# Altium schematic sheet MCU.SchDoc: =ProjectTitle
size 297 x 209 mm; Address1: Address1; Address2: Address2; Address3: Address3; Address4: Address4; SheetNumber: 1; SheetTotal: 6; Scale: 1:1; DocumentType: Схема электрическая принципиальная; Title2str: ?
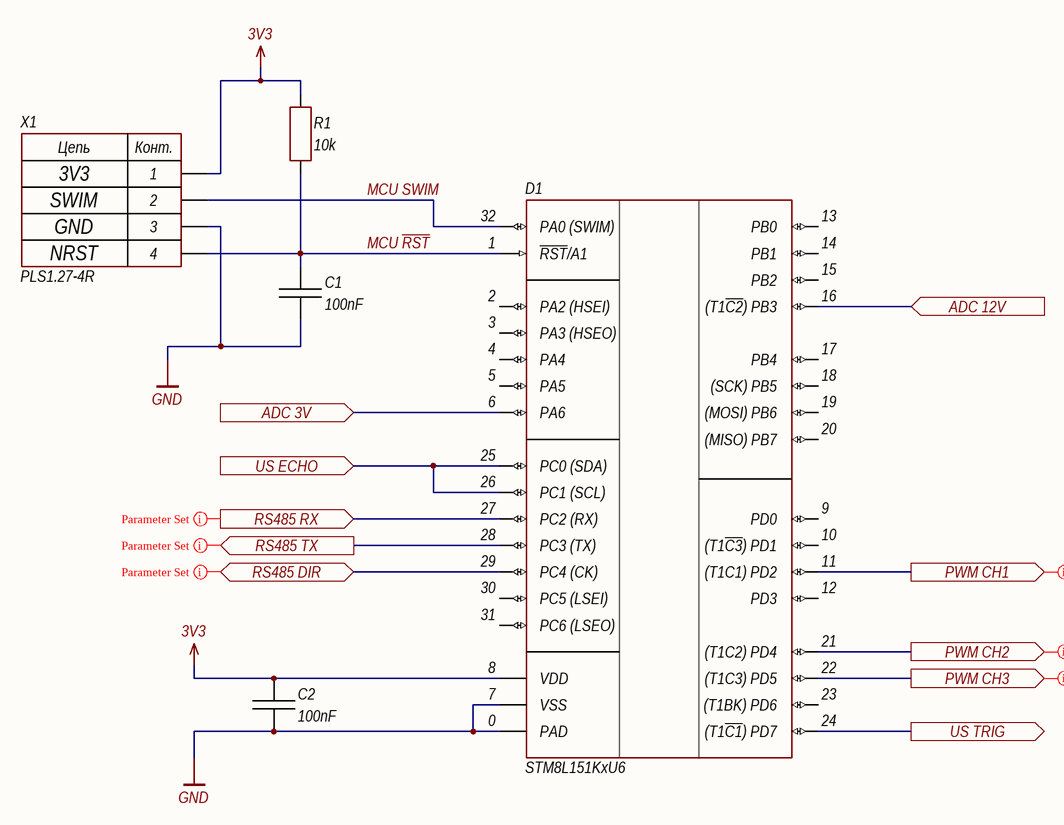
[diagram p0: MCU.SchDoc]

## Parts
C1  100nF  [CH0402C]
C2  100nF  [CH0402C]
D1  STM8L151KxU6  [32-UFQFPN]
R1  10k  [CH0402R]
X1  PLS1.27-4R  [CON: PLS1.27-4R]

## Ports
ADC 3V (in), ADC 12V (in), PWM CH1 (out), PWM CH2 (out), PWM CH3 (out), RS485 DIR (bidir), RS485 RX (in), RS485 TX (out), US ECHO (in), US TRIG (out)

## Nets
3V3: C2.2 D1.8(VDD) R1.2 X1.1
GND: C1.1 C2.1 D1.0(PAD) D1.7(VSS) X1.3
ADC 3V: D1.6(PA6) ; port ADC 3V
ADC 12V: D1.16((T1~{C2})_PB3) ; port ADC 12V
MCU ~{RST}: C1.2 D1.1(~{RST}/A1) R1.1 X1.4
MCU SWIM: D1.32(PA0_(SWIM)) X1.2
PWM CH1: D1.11((T1C1)_PD2) ; port PWM CH1
PWM CH2: D1.21((T1C2)_PD4) ; port PWM CH2
PWM CH3: D1.22((T1C3)_PD5) ; port PWM CH3
RS485 DIR: D1.29(PC4_(CK)) ; port RS485 DIR
RS485 RX: D1.27(PC2_(RX)) ; port RS485 RX
RS485 TX: D1.28(PC3_(TX)) ; port RS485 TX
US ECHO: D1.25(PC0_(SDA)) D1.26(PC1_(SCL)) ; port US ECHO
US TRIG: D1.24((T1~{C1})_PD7) ; port US TRIG

Not connected (* = marked no-connect by the designer): D1 2(PA2_(HSEI)) 3(PA3_(HSEO)) 4(PA4) 5(PA5) 9(PD0) 10((T1~{C3})_PD1) 12(PD3) 13(PB0) 14(PB1) 15(PB2) 17(PB4) 18((SCK)_PB5) 19((MOSI)_PB6) 20((MISO)_PB7) 23((T1BK)_PD6) 30(PC5_(LSEI)) 31(PC6_(LSEO))

## Layout directives
net class RS485 UART; rule Matched Net Lengths [Tolerance = 0.1mm]: RS485 DIR, RS485 RX, RS485 TX
net class PWM LED; rule Matched Net Lengths [Tolerance = 0.1mm]: PWM CH1, PWM CH2, PWM CH3

## Notes on the sheet
- 3V3
- GND
- SWIM
- NRST
- Утв.
- Н.контр.
- Т.контр.
- Пров.
- Разраб.
- Изм.
- Лист
- № докум.
- Подп.
- Дата
- Копировал
- Формат А4
- Лит.
- Листов
- Масса
- Масштаб
- (in symbol 4-Connector) Цепь; Конт.

## Library data of the parts
C1 C2 = Capacitor: Manufacturer: CCTC; Model: TCC0402X7R104K250AT; HelpURL: https://lcsc.com/product-detail/Multilayer-Ceramic-Capacitors-MLCC-SMD-SMT_CCTC-TCC0402X7R104K250AT_C466234.html; ComponentKind: X7R, 50V; Value: 100nF
D1 = STM8L151KxU6: STM8; Manufacturer: ST Microelectronics; Model: STM8L151K4U6; ComponentKind: 1.8-3.6V, UFQFPN32; HelpURL: https://ru.mouser.com/datasheet/2/389/stm8l151c4-956418.pdf
R1 = Resistor: Manufacturer: Uniroyal Elec; Model: 0402WGF1002TCE; HelpURL: https://lcsc.com/product-detail/Chip-Resistor-Surface-Mount_UNI-ROYAL-Uniroyal-Elec-0402WGF1002TCE_C25744.html; ComponentKind: ±1%; Value: 10k
X1 = 4-Connector: Model: PLS1.27-4R; Manufacturer: *; HelpURL: *; ComponentKind: *